# EAGLE design ADD_1_1 (EAGLE 8.3.2)
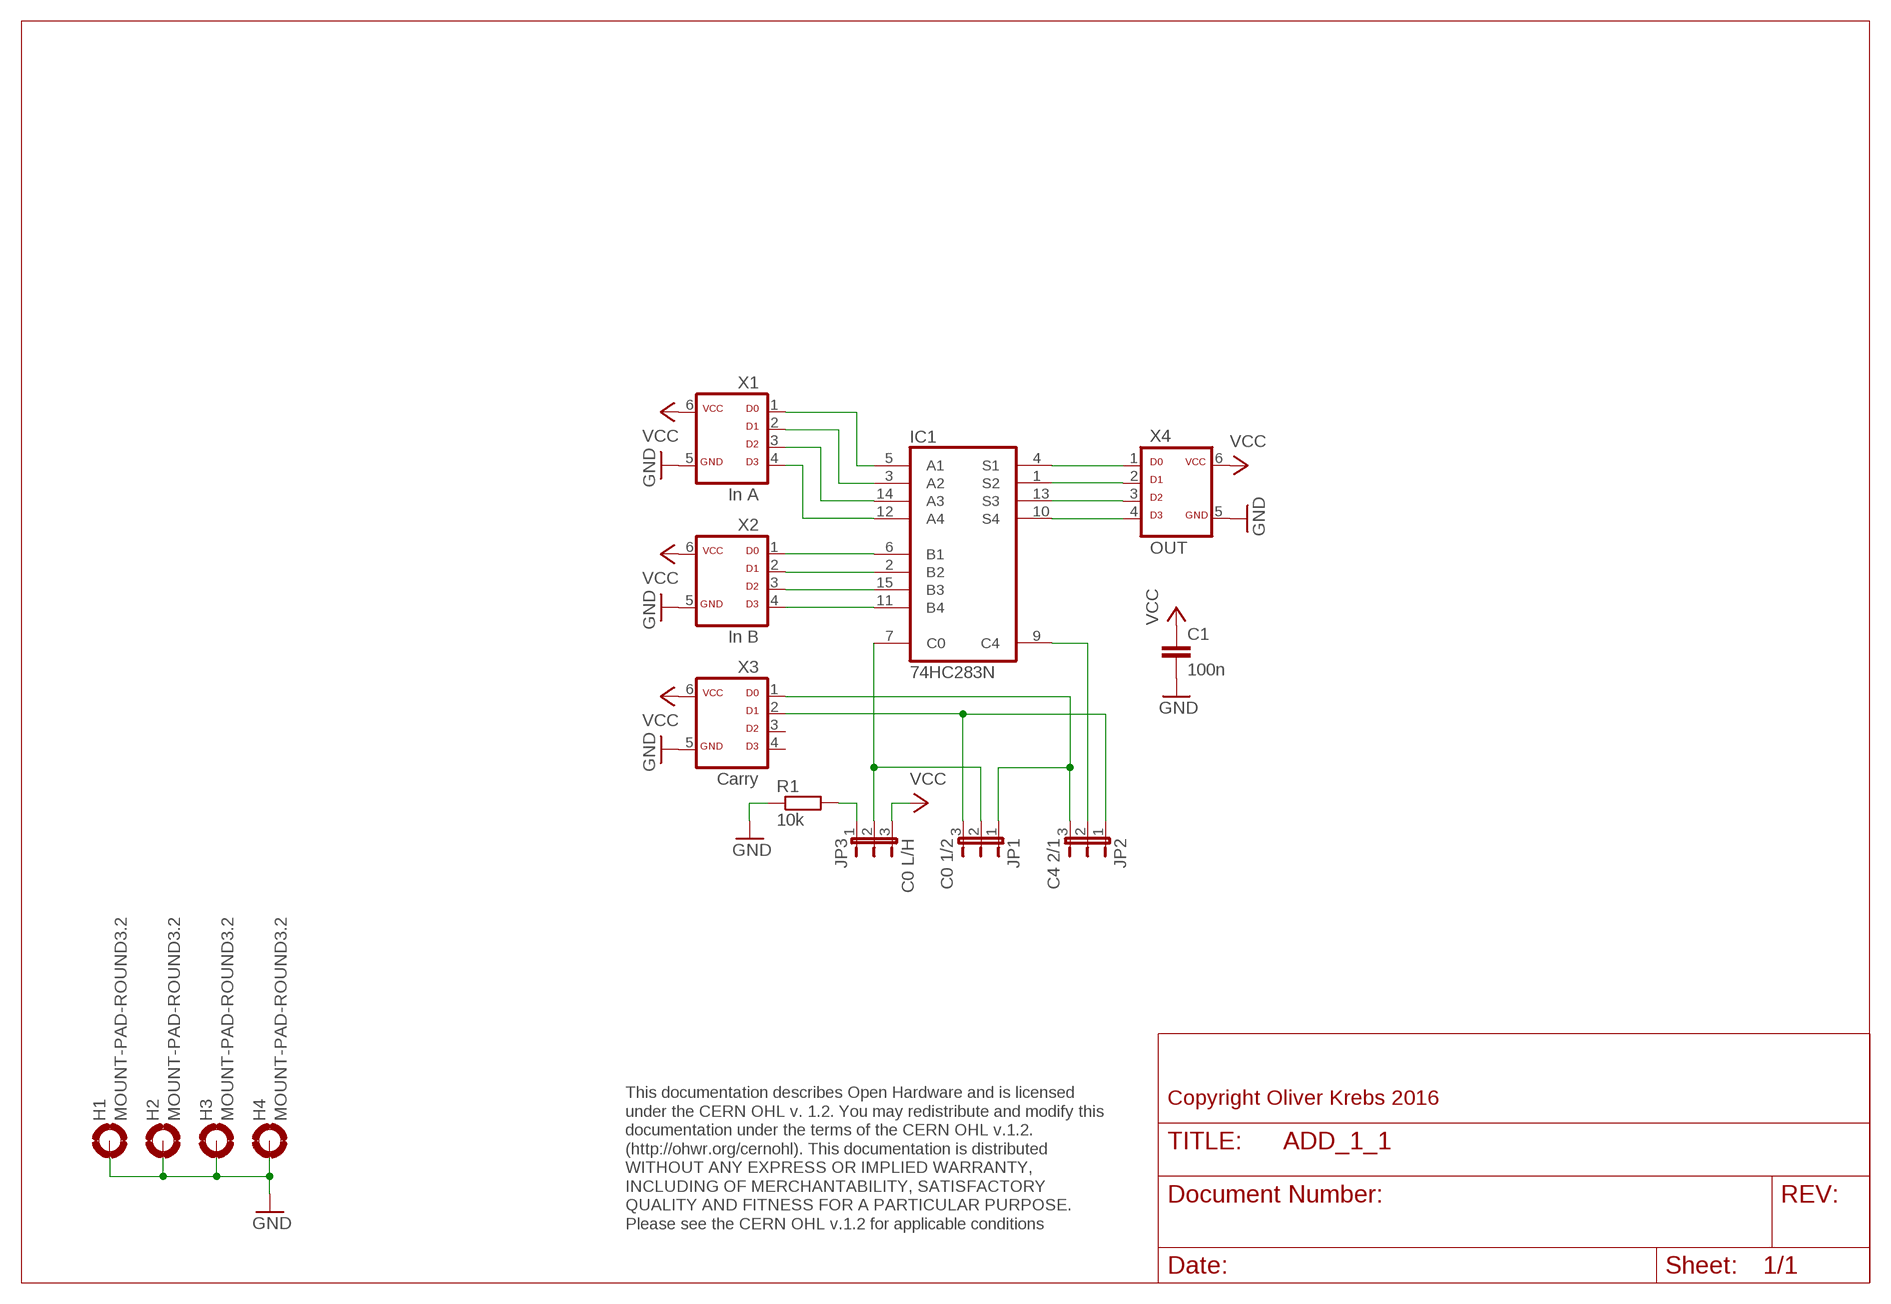
[diagram p0: schematic, sheet 1]

## Parts
C1  100n  C-EU050-025X075  [C050-025X075]
H1  MOUNT-PAD-ROUND3.2  [3,2-PAD]
H2  MOUNT-PAD-ROUND3.2  [3,2-PAD]
H3  MOUNT-PAD-ROUND3.2  [3,2-PAD]
H4  MOUNT-PAD-ROUND3.2  [3,2-PAD]
IC1  74HC283N  [DIL16]
JP1  C0 1/2  JP2E  [JP2]
JP2  C4 2/1  JP2E  [JP2]
JP3  C0 L/H  JP2E  [JP2]
R1  10k  R-EU_0207/10  [0207/10]
X1  In A  ML6D  [ML-6]
X2  In B  ML6D  [ML-6]
X3  Carry  ML6D  [ML-6]
X4  OUT  ML6D  [ML-6]

## Nets
GND: C1.2 H1.B3,2(MOUNT) H2.B3,2(MOUNT) H3.B3,2(MOUNT) H4.B3,2(MOUNT) R1.1 X1.5 X2.5 X3.5 X4.5
N$1: JP3.1 R1.2
N$2: IC1.15(B3) X2.3
N$3: IC1.3(A2) X1.2
N$5: IC1.2(B2) X2.2
N$6: IC1.14(A3) X1.3
N$8: IC1.11(B4) X2.4
N$9: IC1.1(S2) X4.2
N$10: IC1.4(S1) X4.1
N$11: IC1.13(S3) X4.3
N$12: IC1.10(S4) X4.4
N$13: IC1.7(C0) JP1.2 JP3.2
N$14: IC1.9(C4) JP2.2
N$15: JP1.1 JP2.3 X3.1
N$16: JP1.3 JP2.1 X3.2
N$20: IC1.5(A1) X1.1
N$22: IC1.12(A4) X1.4
N$24: IC1.6(B1) X2.1
VCC: C1.1 JP3.3 X1.6 X2.6 X3.6 X4.6
Unconnected: X3.3 X3.4

## Notes on the sheet
- Copyright Oliver Krebs 2016
- This documentation describes Open Hardware and is licensed 
  under the CERN OHL v. 1.2. You may redistribute and modify this 
  documentation under the terms of the CERN OHL v.1.2. 
  (http://ohwr.org/cernohl). This documentation is distributed
  WITHOUT ANY EXPRESS OR IMPLIED WARRANTY, 
  INCLUDING OF MERCHANTABILITY, SATISFACTORY 
  QUALITY AND FITNESS FOR A PARTICULAR PURPOSE. 
  Please see the CERN OHL v.1.2 for applicable conditions

## Power pins joined to a net without a drawn wire
GND: IC1.8(GND)
VCC: IC1.16(VCC)

## Library data of the parts
C1 = 01-my_rcl:C-EU: CAPACITOR, European symbol
H1-H4 = holes:MOUNT-PAD-ROUND: MOUNTING PAD, round
IC1 = 74xx-eu:74*283: 4-bit binary FULL ADDER, fast carry
JP1-JP3 = jumper:JP2E: JUMPER
R1 = 01-my_rcl:R-EU_: RESISTOR, European symbol
X1-X4 = 01-my-con:ML6D

## Board
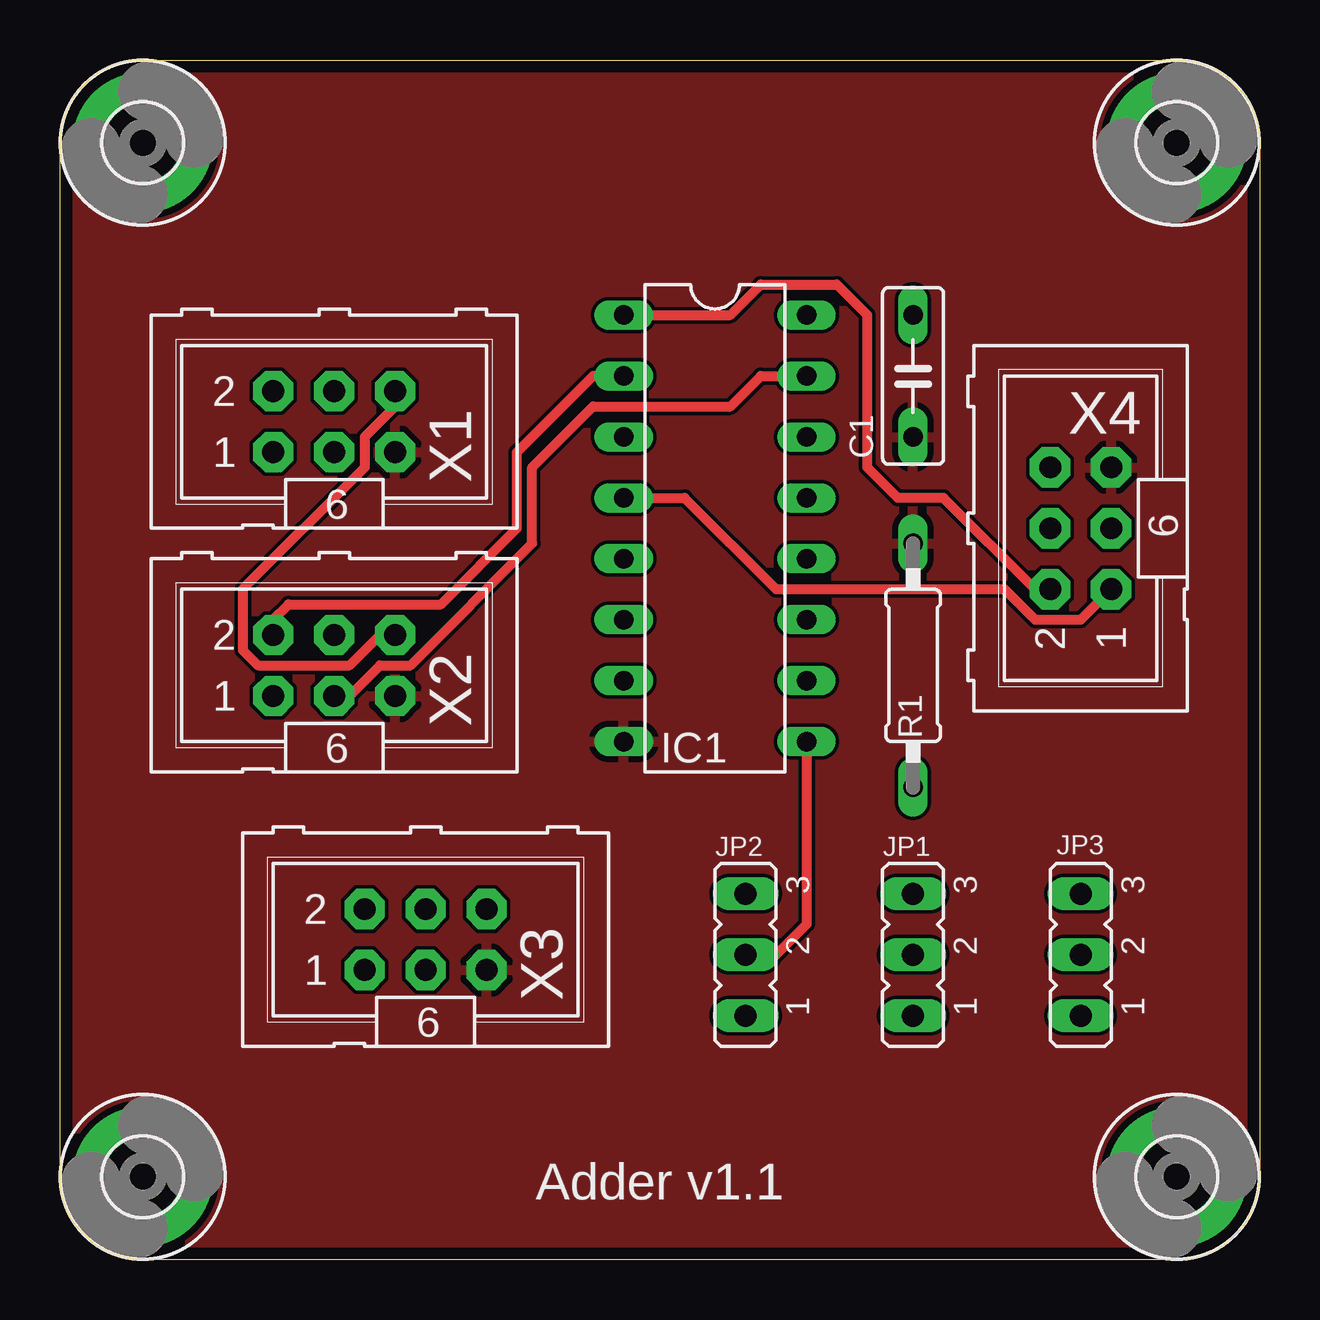
[diagram p1: board, top side]
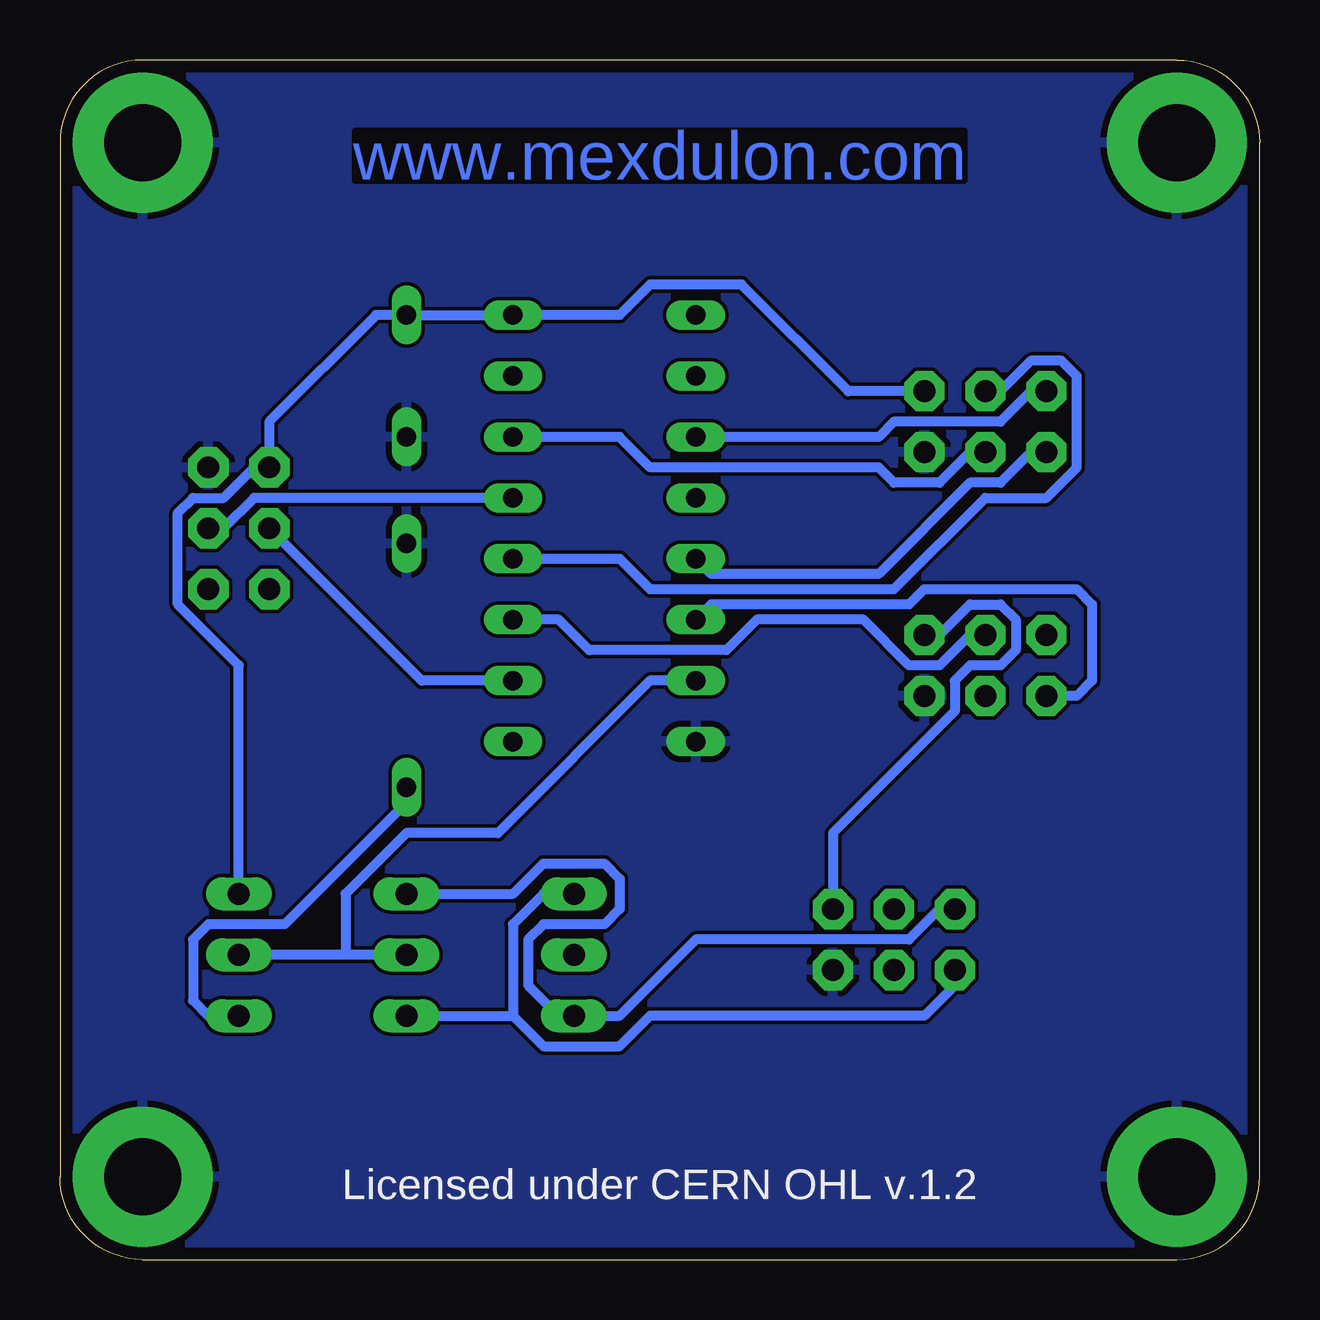
[diagram p2: board, bottom side, seen from below]

Size 50 x 50 mm. Coordinates in mm from the lower left corner, seen from the top.
Outline: 0,3.45 0,46.55 arc-90 3.45,50 46.55,50 arc-90 50,46.55 50,3.45 arc-90 46.55,0 3.45,0 arc-90 0,3.45
Copper layers (1*16): Top 0.035mm / dielectric 1.6mm / Bottom 0.035mm
Design rules "Elecrow_2-layer_PCB_eagle_rule": minimum track width 6mil, minimum drill 12mil, track to track 6mil, track to pad 6mil, pad to pad 6mil, via to via 8mil, smd to smd 0mil, copper to edge 20mil, drill to drill 10mil, minimum pad ring 6mil, minimum via ring 6mil, stop-mask expansion 0mil, vias tented up to drill 100mil, thermal gap 10mil

### Footprints (pad centres in the part's own frame; a part is rotated, then mirrored left to right if it is on the bottom)
C050-025X075 = drill 0.813 long: 1 -2.54,0; 2 2.54,0
3,2-PAD = drill 3.2 pad 5.842: B3,2 0,0
DIL16 = drill 0.813 long: 1 -8.89,-3.81; 2 -6.35,-3.81; 3 -3.81,-3.81; 4 -1.27,-3.81; 5 1.27,-3.81; 6 3.81,-3.81; 7 6.35,-3.81; 8 8.89,-3.81; 9 8.89,3.81; 10 6.35,3.81; 11 3.81,3.81; 12 1.27,3.81; 13 -1.27,3.81; 14 -3.81,3.81; 15 -6.35,3.81; 16 -8.89,3.81
JP2 = drill 0.914 long: 1 -2.54,0; 2 0,0; 3 2.54,0
0207/10 = drill 0.813 long: 1 -5.08,0; 2 5.08,0
ML-6 = drill 0.914 pad 1.676 octagon: 1 -2.54,-1.27; 2 -2.54,1.27; 3 0,-1.27; 4 0,1.27; 5 2.54,-1.27; 6 2.54,1.27

### Placement (x,y rotation side)
C1  35.56,36.83 270 top
H1  3.45,3.45 0 top
H2  3.45,46.55 0 top
H3  46.55,46.55 0 top
H4  46.55,3.45 0 top
IC1  27.3,30.48 270 top
JP1  35.56,12.7 90 top
JP2  28.57,12.7 90 top
JP3  42.55,12.7 90 top
R1  35.56,24.77 270 top
X1  11.43,34.92 0 top
X2  11.43,24.77 0 top
X3  15.24,13.34 0 top
X4  42.55,30.48 90 top

### Tracks (layer width: path | path; a pad name or v marks a point on that pad's centre or on a via)
GND
  pour Top: 0,50.16 50.16,50.16 50.16,0 0,0
  pour Bottom: 0,50.16 50.16,50.16 50.16,0 0,0
N$1
  Bottom 0.406: R1.2 35.56,19.05 40.64,13.97 43.81,13.97 44.45,13.34 44.45,10.79 43.81,10.16 JP3.1
N$2
  Top 0.406: X2.3 12.06,23.5 13.34,24.77 14.61,24.77 19.68,29.84 19.68,33.02 22.23,35.56 27.94,35.56 29.21,36.83 IC1.15
N$3
  Bottom 0.406: X1.2 9.53,36.2 10.79,34.92 15.24,34.92 15.88,34.29 IC1.3
N$5
  Top 0.406: X2.2 8.89,26.67 9.53,27.3 15.88,27.3 19.05,30.48 19.05,33.66 22.23,36.83 IC1.2
N$6
  Bottom 0.406: X1.3 12.06,33.66 13.34,32.38 15.24,32.38 15.88,33.02 25.4,33.02 26.67,34.29 IC1.14
N$8
  Bottom 0.406: IC1.11 29.21,26.67 27.94,25.4 22.23,25.4 20.95,26.67 16.51,26.67 14.61,24.77 13.34,24.77 12.06,26.04 X2.4
N$9
  Top 0.406: X4.2 40.64,27.94 36.83,31.75 34.92,31.75 33.66,33.02 33.66,39.37 32.38,40.64 29.21,40.64 27.94,39.37 IC1.1
N$10
  Top 0.406: IC1.4 26.04,31.75 29.84,27.94 39.37,27.94 40.64,26.67 42.55,26.67 X4.1
N$11
  Bottom 0.406: IC1.13 41.91,31.75 43.18,30.48 X4.3
N$12
  Bottom 0.406: IC1.10 34.92,24.13 X4.4
N$13
  Bottom 0.406: JP1.2 38.1,12.7 | 38.1,12.7 JP3.2 | IC1.7 25.4,24.13 31.75,17.78 35.56,17.78 38.1,15.24 38.1,12.7
N$14
  Top 0.406: IC1.9 31.11,13.97 29.84,12.7 JP2.2
N$15
  Bottom 0.406: X3.1 12.7,11.43 13.97,10.16 25.4,10.16 26.67,8.89 29.84,8.89 31.11,10.16 | JP2.3 29.84,15.24 31.11,13.97 31.11,10.16 | JP1.1 31.11,10.16
N$16
  Bottom 0.406: X3.2 13.34,14.61 14.61,13.34 23.5,13.34 26.67,10.16 JP2.1 29.21,10.16 30.48,11.43 30.48,13.34 29.84,13.97 27.3,13.97 26.67,14.61 26.67,15.88 27.3,16.51 29.84,16.51 31.11,15.24 JP1.3
N$20
  Bottom 0.406: X1.1 9.53,33.66 10.79,32.38 12.06,32.38 15.88,28.57 22.86,28.57 IC1.5
N$22
  Bottom 0.406: IC1.12 26.67,29.21 25.4,27.94 15.24,27.94 11.43,31.75 8.89,31.75 7.62,33.02 7.62,36.83 8.26,37.47 9.53,37.47 10.79,36.2 X1.4
N$24
  Bottom 0.406: X2.1 7.62,23.5 6.99,24.13 6.99,27.3 7.62,27.94 13.97,27.94 14.61,27.3 22.86,27.3 IC1.6
VCC
  Top 0.406: X1.6 13.97,35.56 12.7,34.29 12.7,33.02 7.62,27.94 7.62,25.4 8.26,24.77 12.06,24.77 13.34,26.04 X2.6
  Bottom 0.406: X1.6 17.14,36.2 21.59,40.64 25.4,40.64 26.67,39.37 IC1.16 C1.1 36.83,39.37 41.27,34.92 X4.6 41.91,33.02 43.18,31.75 44.45,31.75 45.09,31.11 45.09,27.3 42.55,24.77 JP3.3 | X2.6 13.34,26.04 12.06,27.3 10.79,27.3 10.16,26.67 10.16,25.4 10.79,24.77 12.06,24.77 12.7,24.13 12.7,22.86 17.78,17.78 X3.6

### Text on the board
Bottom: www.mexdulon.com
tNames: Adder v1.1
bNames: Licensed under CERN OHL v.1.2